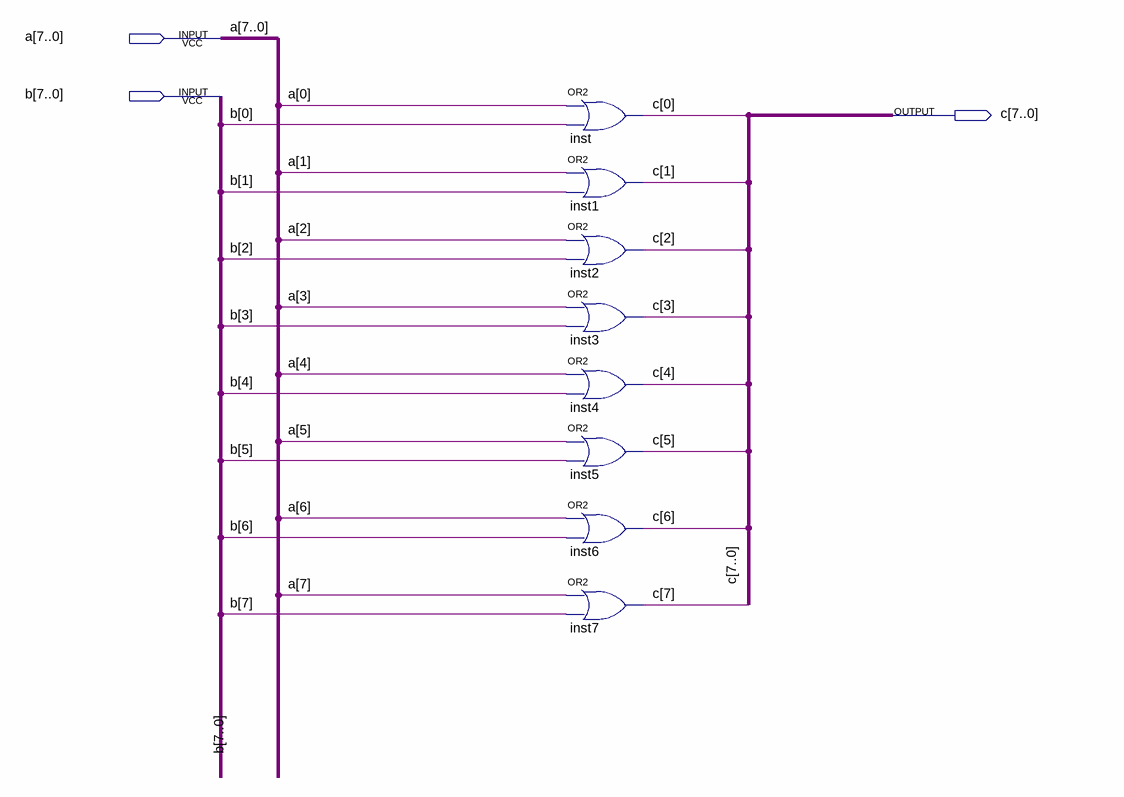
[diagram p0: schematic sheet]
// Quartus schematic ORmodule.bdf as structural Verilog: 8 symbols, 3 pins
module ORmodule (
  input  [7:0] a,
  input  [7:0] b,
  output [7:0] c
);

  or inst (c[0], a[0], b[0]);
  or inst1 (c[1], a[1], b[1]);
  or inst2 (c[2], a[2], b[2]);
  or inst3 (c[3], a[3], b[3]);
  or inst4 (c[4], a[4], b[4]);
  or inst5 (c[5], a[5], b[5]);
  or inst6 (c[6], a[6], b[6]);
  or inst7 (c[7], a[7], b[7]);
endmodule
